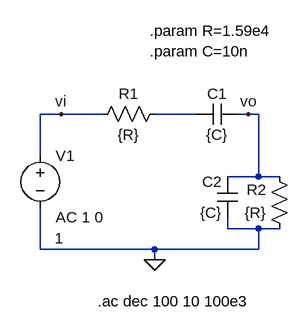
[diagram p0: schematic WienBridgeNetwork.asc]
WienBridgeNetwork.asc, the LTspice schematic file:
Version 4
SHEET 1 880 680
WIRE -144 304 -176 304
WIRE -80 304 -144 304
WIRE 64 304 0 304
WIRE 144 304 128 304
WIRE 160 304 144 304
WIRE -176 368 -176 304
WIRE 160 400 160 304
WIRE 160 400 112 400
WIRE 192 400 160 400
WIRE 112 480 112 464
WIRE 160 480 112 480
WIRE 192 480 160 480
WIRE -176 512 -176 448
WIRE 0 512 -176 512
WIRE 160 512 160 480
WIRE 160 512 0 512
WIRE 0 528 0 512
FLAG 0 528 0
FLAG -144 304 vi
FLAG 144 304 vo
SYMBOL res 208 496 R180
WINDOW 0 36 76 Left 2
WINDOW 3 36 40 Left 2
SYMATTR InstName R2
SYMATTR Value {R}
SYMBOL res 16 288 R90
WINDOW 0 0 56 VBottom 2
WINDOW 3 32 56 VTop 2
SYMATTR InstName R1
SYMATTR Value {R}
SYMBOL cap 128 288 R90
WINDOW 0 0 32 VBottom 2
WINDOW 3 32 32 VTop 2
SYMATTR InstName C1
SYMATTR Value {C}
SYMBOL cap 128 464 R180
WINDOW 0 24 56 Left 2
WINDOW 3 24 8 Left 2
SYMATTR InstName C2
SYMATTR Value {C}
SYMBOL voltage -176 352 R0
WINDOW 3 22 143 Left 2
WINDOW 123 24 111 Left 2
WINDOW 39 0 0 Left 0
SYMATTR InstName V1
SYMATTR Value 1
SYMATTR Value2 AC 1 0
TEXT -8 176 Left 2 !.param R=1.59e4\n.param C=10n
TEXT -88 592 Left 2 !.ac dec 100 10 100e3

The netlist it stands for:
* WienBridgeNetwork.asc
R2 0 vo {R}
R1 N001 vi {R}
C1 vo N001 {C}
C2 0 vo {C}
V1 vi 0 1 AC 1 0
.param R=1.59e4
.param C=10n
.ac dec 100 10 100e3
.backanno
.end